# Altium project Highway_Final_Version.PrjPcb (part 1 of 2)
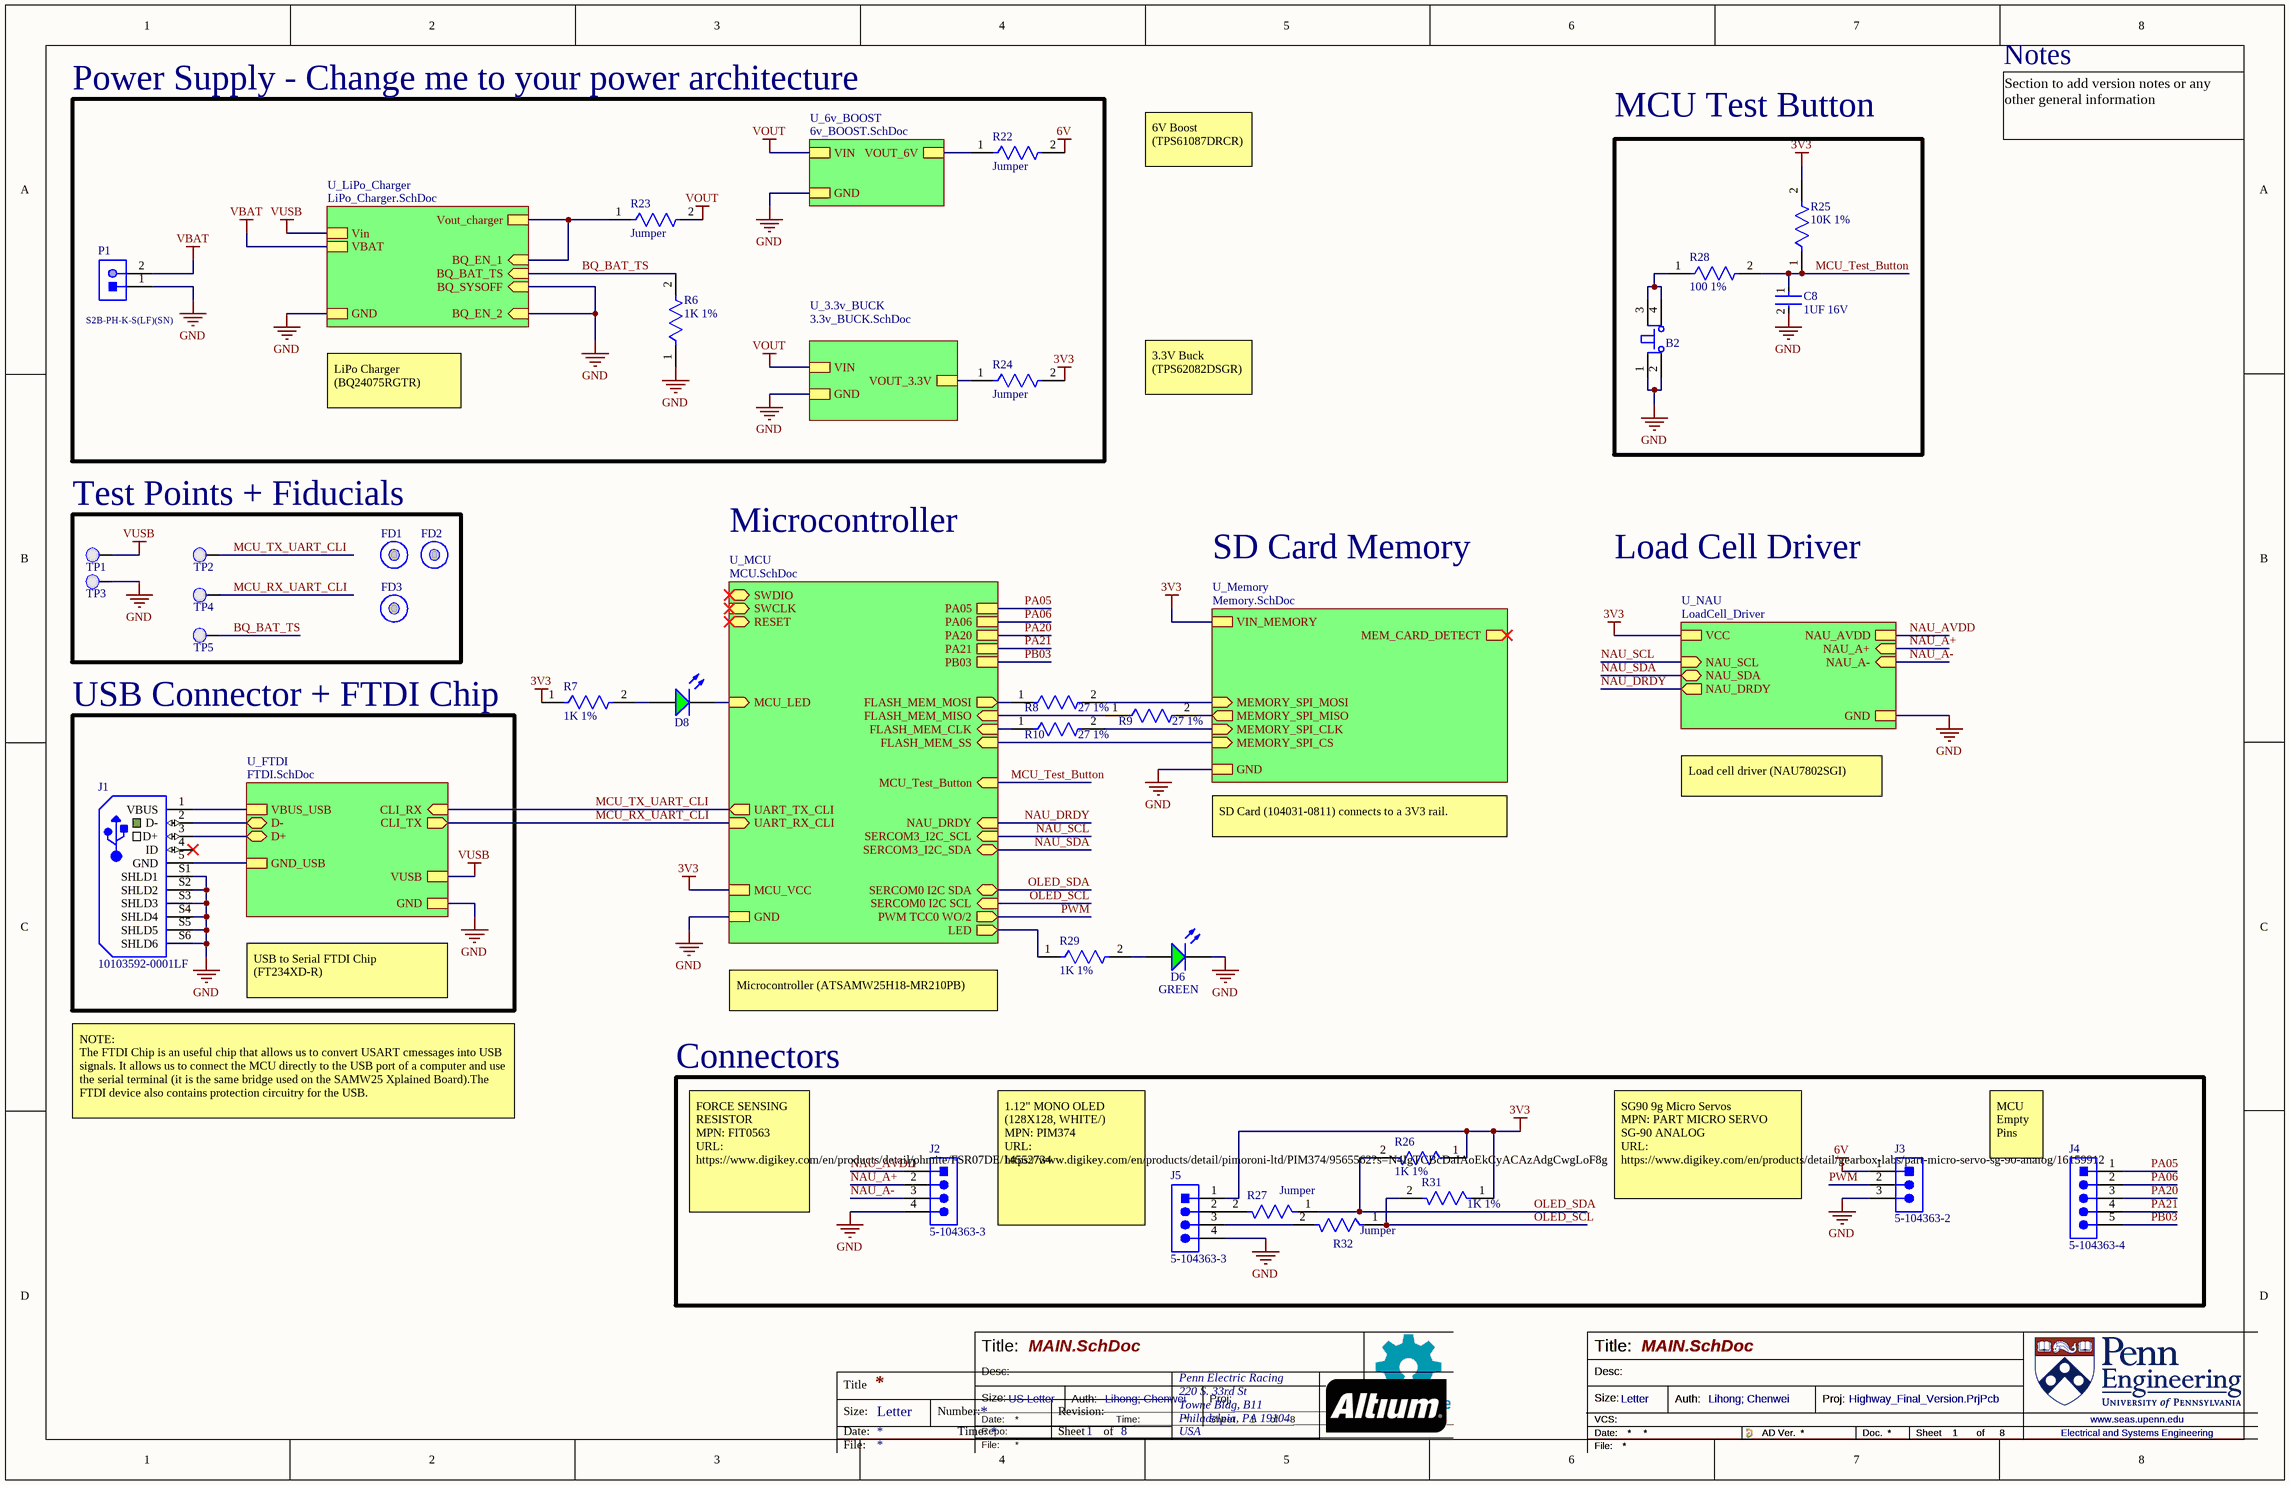
[diagram p0: MAIN.SchDoc]
8 sheets, 127 parts. Net scope: strictly hierarchical (ports join the sheet entries above them; power ports are local).
Board file: ESE516_PCB.PcbDoc
Sheets:
  MAIN.SchDoc
    U_FTDI = FTDI.SchDoc
    U_MCU = MCU.SchDoc
    U_Memory = Memory.SchDoc
    U_LiPo_Charger = LiPo_Charger.SchDoc
    U_6v_BOOST = 6v_BOOST.SchDoc
    U_3.3v_BUCK = 3.3v_BUCK.SchDoc
    U_NAU = LoadCell_Driver.SchDoc

## Sheet MAIN.SchDoc
size Tabloid; Author: Lihong; Chenwei; CompanyName: Penn Electric Racing; DrawnBy: Lihong; Chenwei; Engineer: Lihong; Chenwei; Organization: Penn Electric Racing; Address1: 220 S. 33rd St; Address2: Towne Bldg, B11; Address3: Philadelpia, PA 19104; Address4: USA; SheetNumber: 1; SheetTotal: 8

### Parts
B2  PTS810SJK250SMTRLFS  [PTS810SJK250SMTRLFS-Footprint-1]  (value not drawn)
C8  1UF 16V  [FP-CC0603-DA-MFG]
D6  GREEN  [LED_0805]
D8  LSM0805452V  [LED_0805]  (value not drawn)
FD1  Fiducial 40x100mm  [Fiducial 40x100mm-Footprint-1]  (value not drawn)
FD2  Fiducial 40x100mm  [Fiducial 40x100mm-Footprint-1]  (value not drawn)
FD3  Fiducial 40x100mm  [Fiducial 40x100mm-Footprint-1]  (value not drawn)
J1  10103592-0001LF  [10103592-0001LF-Footprint-1]
J2  5-104363-3  [5-104363-3-Footprint-1]
J3  5-104363-2  [5-104363-2-Footprint-1]
J4  5-104363-4  [5-104363-4-Footprint-1]
J5  5-104363-3  [5-104363-3-Footprint-1]
P1  S2B-PH-K-S(LF)(SN)  [JST-S2B-PH-K-S_V]
R6  1K 1%  [FP-RNCP0603-IPC_C]
R7  1K 1%  [FP-RNCP0603-IPC_C]
R8  27 1%  [FP-RMCF0603-IPC_B]
R9  27 1%  [FP-RMCF0603-IPC_B]
R10  27 1%  [FP-RMCF0603-IPC_B]
R22  Jumper  [FP-RMCF0603-MFG]
R23  Jumper  [FP-RMCF0603-MFG]
R24  Jumper  [FP-RMCF0603-MFG]
R25  10K 1%  [FP-RNCP0603-IPC_A]
R26  1K 1%  [FP-RNCP0603-IPC_C]
R27  Jumper  [FP-RMCF0603-MFG]
R28  100 1%  [FP-RMCF0603-IPC_C]
R29  1K 1%  [FP-RNCP0603-IPC_C]
R31  1K 1%  [FP-RNCP0603-IPC_C]
R32  Jumper  [FP-RMCF0603-MFG]
TP1  Test Point 0.1"  [Test Point 0.1"-Footprint-1]  (value not drawn)  (no BOM)
TP2  Test Point 0.1"  [Test Point 0.1"-Footprint-1]  (value not drawn)
TP3  Test Point 0.1"  [Test Point 0.1"-Footprint-1]  (value not drawn)
TP4  Test Point 0.1"  [Test Point 0.1"-Footprint-1]  (value not drawn)
TP5  Test Point 0.1"  [Test Point 0.1"-Footprint-1]  (value not drawn)

### Blocks framed on the sheet
Power Supply - Change me to your power architecture: P1 R6 R22-R24
MCU Test Button: B2 C8 R25 R28
Test Points + Fiducials: FD1-FD3 TP1-TP5
USB Connector + FTDI Chip: J1
Connectors: J2-J5 R26 R27 R31 R32

### Sub-sheets
U_3.3v_BUCK = 3.3v_BUCK.SchDoc: VIN, GND, VOUT_3.3V
U_6v_BOOST = 6v_BOOST.SchDoc: VIN, VOUT_6V, GND
U_FTDI = FTDI.SchDoc: CLI_RX (in), CLI_TX (out), VUSB, GND, VBUS_USB, D- (bidir), D+ (bidir), GND_USB
U_LiPo_Charger = LiPo_Charger.SchDoc: BQ_EN_2 (in), BQ_SYSOFF (in), BQ_EN_1 (in), BQ_BAT_TS (in), Vin, GND, VBAT, Vout_charger
U_MCU = MCU.SchDoc: SWDIO (bidir), SWCLK (in), UART_TX_CLI (out), UART_RX_CLI (in), FLASH_MEM_SS (in), FLASH_MEM_CLK (in), FLASH_MEM_MISO (in), FLASH_MEM_MOSI (out), RESET (bidir), MCU_LED (in), MCU_VCC, GND, SERCOM0 I2C SDA (bidir), SERCOM0 I2C SCL (in), PWM TCC0 WO/2 (out), LED (out), PA05, PA06, PA20, PA21, PB03, MCU_Test_Button (in), NAU_DRDY (in), SERCOM3_I2C_SCL (in), SERCOM3_I2C_SDA (bidir)
U_Memory = Memory.SchDoc: MEMORY_SPI_MOSI (in), MEMORY_SPI_MISO (out), MEMORY_SPI_CLK (in), MEMORY_SPI_CS (in), MEM_CARD_DETECT (out), VIN_MEMORY, GND
U_NAU = LoadCell_Driver: VCC, GND, NAU_AVDD, NAU_SCL (in), NAU_SDA (bidir), NAU_DRDY (out), NAU_A- (in), NAU_A+ (in)

### Nets
3V3: J5.1 R7.1 R24.2 R25.2 R26.1 R31.1 ; sheet U_MCU/MCU_VCC, sheet U_Memory/VIN_MEMORY, sheet U_NAU/VCC
6V: J3.1 R22.2
6V_out: R22.1 ; sheet U_6v_BOOST/VOUT_6V
GND: B2.1 B2.2 C8.2 D6.K J1.5(GND) J1.S1(SHLD1) J1.S2(SHLD2) J1.S3(SHLD3) J1.S4(SHLD4) J1.S5(SHLD5) J1.S6(SHLD6) J2.4 J3.3 J5.4 P1.1 R6.1 TP3.1(PAD) ; sheet U_FTDI/GND, sheet U_FTDI/GND_USB, sheet U_MCU/GND, sheet U_Memory/GND, sheet U_LiPo_Charger/BQ_EN_2, sheet U_LiPo_Charger/BQ_SYSOFF, sheet U_LiPo_Charger/GND, sheet U_6v_BOOST/GND, sheet U_3.3v_BUCK/GND, sheet U_NAU/GND
NAU_AVDD: J2.1 ; sheet U_NAU/NAU_AVDD  [project net AVDD]
VBAT: P1.2 ; sheet U_LiPo_Charger/VBAT
VBUS: J1.1(VBUS) ; sheet U_FTDI/VBUS_USB
VOUT: R23.2 ; sheet U_6v_BOOST/VIN, sheet U_3.3v_BUCK/VIN
Vout_BQ: R23.1 ; sheet U_LiPo_Charger/BQ_EN_1, sheet U_LiPo_Charger/Vout_charger
VUSB: TP1.1(PAD) ; sheet U_FTDI/VUSB, sheet U_LiPo_Charger/Vin
BQ_BAT_TS: R6.2 TP5.1(PAD) ; sheet U_LiPo_Charger/BQ_BAT_TS
FLASH_MEM_SPI_SS: sheet U_MCU/FLASH_MEM_SS, sheet U_Memory/MEMORY_SPI_CS
MCU_LED: D8.K ; sheet U_MCU/MCU_LED
MCU_RX_UART_CLI: TP4.1(PAD) ; sheet U_FTDI/CLI_TX, sheet U_MCU/UART_RX_CLI
MCU_Test_Button: C8.1 R25.1 R28.2 ; sheet U_MCU/MCU_Test_Button
MCU_TX_UART_CLI: TP2.1(PAD) ; sheet U_FTDI/CLI_RX, sheet U_MCU/UART_TX_CLI
MEM_SPI_CLK: R10.2 ; sheet U_Memory/MEMORY_SPI_CLK
MEM_SPI_MISO: R9.2 ; sheet U_Memory/MEMORY_SPI_MISO
MEM_SPI_MOSI: R8.2 ; sheet U_Memory/MEMORY_SPI_MOSI
NAU_A+: J2.2 ; sheet U_NAU/NAU_A+
NAU_A-: J2.3 ; sheet U_NAU/NAU_A-
NAU_DRDY: sheet U_MCU/NAU_DRDY, sheet U_NAU/NAU_DRDY
NAU_SCL: sheet U_MCU/SERCOM3_I2C_SCL, sheet U_NAU/NAU_SCL
NAU_SDA: sheet U_MCU/SERCOM3_I2C_SDA, sheet U_NAU/NAU_SDA
OLED_SCL: R31.2 R32.1 ; sheet U_MCU/SERCOM0 I2C SCL
OLED_SDA: R26.2 R27.1 ; sheet U_MCU/SERCOM0 I2C SDA
PA03: R29.1 ; sheet U_MCU/LED
PA05: J4.1 ; sheet U_MCU/PA05
PA06: J4.2 ; sheet U_MCU/PA06
PA20: J4.3 ; sheet U_MCU/PA20
PA21: J4.4 ; sheet U_MCU/PA21
PB03: J4.5 ; sheet U_MCU/PB03
PWM: J3.2 ; sheet U_MCU/PWM TCC0 WO/2
SERCOM1_PAD2_SPI_MISO: R9.1 ; sheet U_MCU/FLASH_MEM_MISO
SERCOM1_PAD2_SPI_MOSI: R8.1 ; sheet U_MCU/FLASH_MEM_MOSI
SERCOM1_PAD3_SPI_SCK: R10.1 ; sheet U_MCU/FLASH_MEM_CLK
USB_DATA_N: J1.2(D-) ; sheet U_FTDI/D-
USB_DATA_P: J1.3(D+) ; sheet U_FTDI/D+
VOS: R24.1 ; sheet U_3.3v_BUCK/VOUT_3.3V
NetB2_3: B2.3 B2.4 R28.1
NetD6_A: D6.A R29.2
NetD8_A: D8.A R7.2
NetJ5_2: J5.2 R27.2
NetJ5_3: J5.3 R32.2

Not connected (* = marked no-connect by the designer): J1 4(ID)*

### Notes on the sheet
- Notes
- 6V Boost (TPS61087DRCR)
- Section to add version notes or any other general information
- LiPo Charger (BQ24075RGTR)
- 3.3V Buck (TPS62082DSGR)
- Microcontroller
- SD Card Memory
- Load Cell Driver
- SD Card (104031-0811) connects to a 3V3 rail.
- Load cell driver (NAU7802SGI)
- USB to Serial FTDI Chip (FT234XD-R)
- Microcontroller (ATSAMW25H18-MR210PB)
- NOTE:
  The FTDI Chip is an useful chip that allows us to convert USART cmessages into USB signals. It allows us to connect the MCU directly to the USB port of a computer and use the serial terminal (it is the same bridge used on the SAMW25 Xplained Board).The FTDI device also contains protection circuitry for the USB.
- MCU Empty Pins
- FORCE SENSING RESISTOR
  MPN: FIT0563
  URL: https://www.digikey.com/en/products/detail/ohmite/FSR07DE/14552734
- 1.12" MONO OLED (128X128, WHITE/)
  MPN: PIM374
  URL: https://www.digikey.com/en/products/detail/pimoroni-ltd/PIM374/9565562?s=N4IgTCBcDaIAoEkCyACAzAdgCwgLoF8g
- SG90 9g Micro Servos
  MPN: PART MICRO SERVO SG-90 ANALOG
  URL: https://www.digikey.com/en/products/detail/gearbox-labs/part-micro-servo-sg-90-analog/16159912
- Title:
- Desc:
- Title
- Size:
- Date:
- Letter
- Number:
- Time:
- File:
- Repo:
- US Letter
- Revision:
- Sheet
- Auth:
- of
- Proj:
- www.seas.upenn.edu
- Electrical and Systems Engineering

### Library data of the parts
B2 = CMP-00084-2: Keypad Switch, 1 Switches, SPST, Momentary-tactile, 0.05A, 16VDC, 3.23N, Solder Terminal, Surface Mount-straight; Manufacturer Series: PTS810; Actuator Length: 0.028inch; Electrical Life: 50000Cycles; Contact Resistance: 0.5mR; Solderability: REFLOW; Actuator Travel: 0.1524mm; Actuator Color: White; Actuator Type: Pushbutton; Insulation Resistance: 100MR; Dielectric Withstand Volts: 250VACV; Switch Function: OFF-MOM; Reach SVHC Compliant: Yes; Terminal Finish: Silver; Switch Type: Keypad; Switch Action: MOMENTARY; RoHS Compliant: Yes; JESD-609 Code: e4; Max Operating Temperature: 85°C; Termination: Solder; Min Operating Temperature: -40°C; Mounting Technology: Surface Mount; Circuit: SPST; Type: Tactile
C8 = CMP-03422-001047-1: CC0603 1 uF X7R 10.00% 16 V; Manufacturer: YAGEO; Manufacturer Part Number: CC0603KPX7R7BB105; Temperature Coefficient: 15%; Tolerance: 0.1; Material: Ceramic; Device Class L3: Ceramic Capacitors; Temperature Characteristic: X7R; Device Class L2: Capacitors; Temperature Range Low: -55°C; Footprint Url: http://www.yageo.com/exep/pages/download/literatures/UPY-C_GEN_24.pdf; Device Class L1: Passive Components; Temperature: -55°C to +125°C; Voltage Rating: 16 V; RoHS: TRUE; ComponentLink2URL: http://www.yageo.com/documents/recent/UPY-GPHC_X7R_6.3V-to-50V_18.pdf; Mouser Description: Cap Ceramic 1uF 16V X7R 10% SMD 0603 125°C Paper T/R; Octopart: https://octopart.com/cc0603kpx7r7bb105-yageo-25629533; Automotive: No; Capacitance: 1 uF; Height: 0.9mm; Voltage: 16 V; Lead Free: Yes; Category: Cap; Package: CC0603-DA; Temperature Range High: +125°C; Value: 1 uF; ComponentLink2Description: Datasheet
D6 D8 = CMP-00038-3: Single Color LED, Green, 0805; Test Current: 20mA; Forward Voltage: 2V; RoHS Compliant: Yes
FD1-FD3 = CMP-00085-1
J1 = CMP-00092-5: Conn Micro USB 2.0 Type B RCP 5 POS 0.65mm Solder RA SMD 5 Terminal 1 Port T/R
J2 J5 = CMP-00105-2: Board Connector, 4 Contact(s), 1 Row(s), Male, Straight, 0.1 inch Pitch, Solder Terminal, Locking, Black Insulator, Plug
J3 = CMP-00106-1: Board Connector, 3 Contact(s), 1 Row(s), Male, Straight, 0.1 inch Pitch, Solder Terminal, Latch, Black Insulator, Plug
J4 = CMP-00107-1: Board Connector, 5 Contact(s), 1 Row(s), Male, Straight, 0.1 inch Pitch, Solder Terminal, Locking, Black Insulator, Plug
P1 = CMP-1755-00004-1: Male Header, Pitch 2 mm, 1 x 2 Position, Height 4.8 mm, Tail Length 3.4 mm, -25 to 85 degC, RoHS, Bulk; Case\Package: Radial; Tolerance: 20%; Capacitance: 10 uF; Voltage Rating (DC): 50 V; Packaging: Bulk; ComponentLink1URL: http://www.jst-mfg.com/product/pdf/eng/ePH.pdf; Radiation Hardening: No; Height: 11 mm; Package Quantity: 200; PackageDescription: Male Header, Pitch 2 mm, 1 x 2 Position, Height 4.8 mm, Tail Length 3.4 mm; PackageReference: S2B-PH-K-S; Diameter: 5 mm; Pins: 2; Mount: Through Hole; Max Operating Temperature: 85 degC; Min Operating Temperature: -40 degC; ComponentLink1Description: Datasheet; DatasheetVersion: Dec-12; Length: 11 mm; Lead Pitch: 2 mm; REACH SVHC: No SVHC; Voltage Rating: 50 V; RoHSCompliant: true
R6 R7 R26 R29 R31 = CMP-26527-006179-1: 1kΩ ±1% 0.125W 0603 High Power Anti-Sulfur Thin Film Chip Resistor; Temperature Coefficient: 100ppm/°C; Max Power Dissipation: 125mW; Resistance: 1kR; Case/Package: 0603; Width: 0.031inch; Tolerance: 1%; Case Code (Imperial): 0603; RoHS Compliant: Yes; Min Operating Temperature: -55°C; Resistor Type: Thin Film; Features: Moisture Resistant; Length: 0.059inch; Mount: Surface Mount; Case Code (Metric): 1608; Height: 0.02inch; Max Operating Temperature: 155°C; Packaging: Tape and Reel; Series: RNCP; Number of Terminations: 2
R8-R10 = CMP-26527-005743-1: 27Ω ±1% 0.1W 0603 Thick Film Chip Resistor AEC-Q200 compliant; Max Power Dissipation: 100mW; Resistance: 27R; Temperature Coefficient: 100ppm/°C; Case/Package: 0603; Contact Plating: Tin; Packaging: Tape and Reel; Length: 0.061inch; Radiation Hardening: No; Mount: Surface Mount; Series: RMCF; Min Operating Temperature: -55°C; Lead Free: Lead Free; Width: 0.031inch; Resistor Type: Thick Film; Max Operating Temperature: 155°C; RoHS Compliant: Yes; Case Code (Imperial): 0603; Height: 0.022inch; Number of Terminations: 2; Case Code (Metric): 1608; Tolerance: 1%; Features: Automotive AEC-Q200
R22-R24 R27 R32 = CMP-26527-000011-1: RES 0 OHM JUMPER 1/10W 0603; Manufacturer Part Number: RMCF0603ZT0R00; Manufacturer: Stackpole; Power Rating: 0.1W; Voltage Rating: 75V; Resistance: 0mΩ; Automotive Grade: Grade 0; Value: 0mΩ; Series: RMCF; Device Class L1: Passive Components; Device Class L3: Chip SMD Resistors; Octopart: https://octopart.com/rmcf0603zt0r00-stackpole+electronics-19213618; Temperature: -55°C to +155°C; Lead Free: Yes; ComponentLink2URL: https://www.seielect.com/catalog/sei-rmcf_rmcp.pdf; Height: 0.55mm; Composition: Thick Film; Package: RMCF0603; Automotive: Yes; Temperature Range High: +155°C; Ipc Land Pattern Name: RESC15580X45; Digikey Description: RES 0 OHM JUMPER 1/10W 0603; RoHS: TRUE; ComponentLink2Description: Datasheet; Temperature Range Low: -55°C; Category: Res; Device Class L2: Resistors
R25 = CMP-26527-000099-1: 10kΩ ±1% 0.125W 0603 High Power Anti-Sulfur Thin Film Chip Resistor; Resistance: 10kR; Max Power Dissipation: 125mW; Temperature Coefficient: 100ppm/°C; Max Operating Temperature: 155°C; Width: 0.031inch; Height: 0.02inch; Lead Free: Lead Free; Contact Plating: Tin; Tolerance: 1%; Resistor Type: Thin Film; Series: RNCP; RoHS Compliant: Yes; Features: Moisture Resistant; Min Operating Temperature: -55°C; Case Code (Metric): 1608; Case/Package: 0603; Mount: Surface Mount; Packaging: Tape and Reel; Radiation Hardening: No; Length: 0.059inch; Number of Terminations: 2; Case Code (Imperial): 0603
R28 = CMP-26527-006079-1: 100Ω ±1% 0.1W 0603 Thick Film Chip Resistor AEC-Q200 compliant; Resistance: 100R; Power Rating: 100mW; Temperature Coefficient: 100ppm/°C; Radiation Hardening: No; Case Code (Metric): 1608; RoHS Compliant: Yes; Height: 0.022inch; Case/Package: 0603; Construction: Rectangular; Case Code (Imperial): 0603; Series: RMCF; Military Standard: Not; Max Operating Temperature: 155°C; Resistor Type: Thick Film; Depth: 0.8mm; Features: Automotive AEC-Q200; Width: 0.031inch; Length: 1.55mm; Size Code: 0603; Mount: Surface Mount; Contact Plating: Tin; Max Power Dissipation: 100mW; Number of Terminations: 2; Min Operating Temperature: -55°C; Packaging: Tape and Reel; Lead Free: Lead Free; Tolerance: 1%
TP1-TP5 = CMP-00086-1

## Sheet FTDI.SchDoc
size Letter; Author: Lihong; Chenwei; SheetNumber: 5; SheetTotal: 8
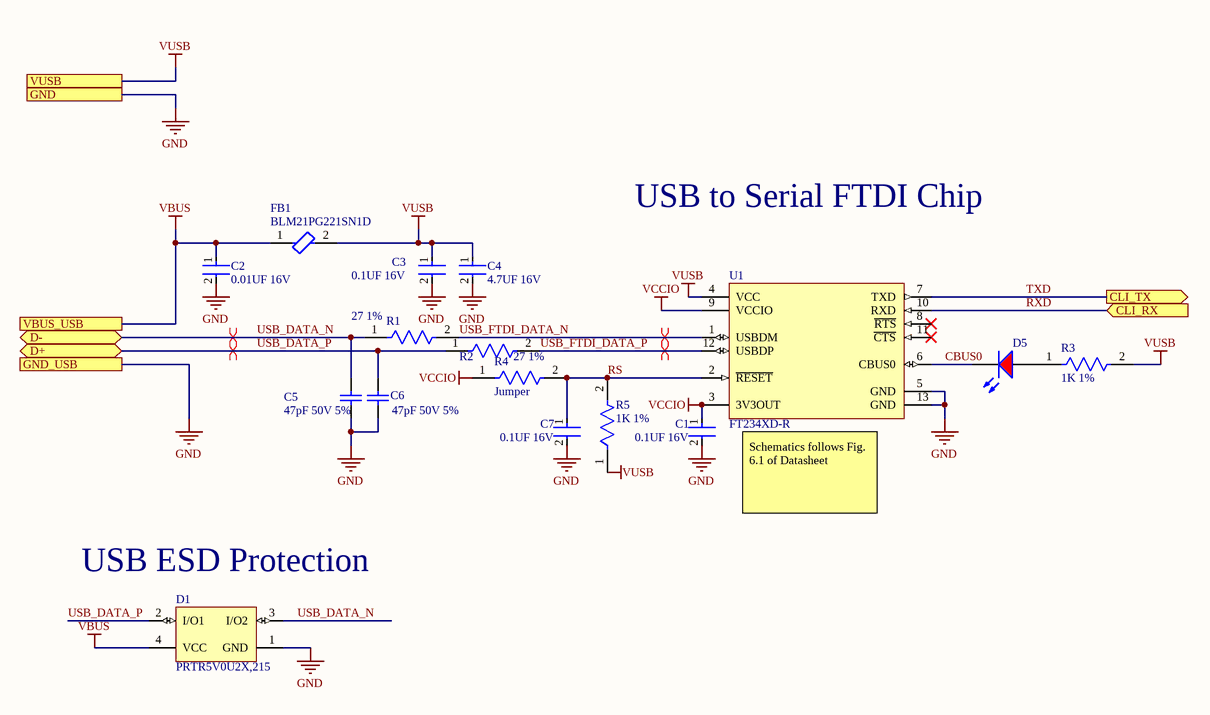
[diagram p1: FTDI.SchDoc]

### Parts
C1  0.1UF 16V  [FP-CC0402-MFG]
C2  0.01UF 16V  [FP-CC0402-MFG]
C3  0.1UF 16V  [FP-CC0402-MFG]
C4  4.7UF 16V  [FP-CC0402-MFG]
C5  47pF 50V 5%  [0603_CAP]
C6  47pF 50V 5%  [0603_CAP]
C7  0.1UF 16V  [FP-CC0402-MFG]
D1  PRTR5V0U2X,215  [NXP-SOT143B-4_V]
D5  LSM0805412V  [LED_0805_RED]  (value not drawn)
FB1  BLM21PG221SN1D  [FP-BLM21-0_2-t0_85-e0_5-IPC_B]
R1  27 1%  [FP-RMCF0603-IPC_B]
R2  27 1%  [FP-RMCF0603-IPC_B]
R3  1K 1%  [FP-RNCP0603-IPC_C]
R4  Jumper  [FP-RMCF0603-MFG]
R5  1K 1%  [FP-RNCP0603-IPC_C]
U1  FT234XD-R  [FP-DFN-12-MFG]

### Ports
CLI_RX (in), CLI_TX (out), D+ (bidir), D- (bidir), GND, GND_USB, VBUS_USB, VUSB

### Nets
GND: C1.2 C2.2 C3.2 C4.2 C5.1 C6.1 C7.2 D1.1(GND) U1.5(GND) U1.13(GND) ; port GND, port GND_USB
VBUS: C2.1 D1.4(VCC) FB1.1 ; port VBUS_USB
VCCIO: C1.1 R4.1 U1.3(3V3OUT) U1.9(VCCIO)
VUSB: C3.1 C4.1 FB1.2 R3.2 R5.1 U1.4(VCC) ; port VUSB
CBUS0: D5.K U1.6(CBUS0)
RS: C7.1 R4.2 R5.2 U1.2(~{RESET})
RXD: U1.10(RXD) ; port CLI_RX  [project net MCU_TX_UART_CLI]
TXD: U1.7(TXD) ; port CLI_TX  [project net MCU_RX_UART_CLI]
USB_DATA_N: C5.2 D1.3(I/O2) R1.1 ; port D-
USB_DATA_P: C6.2 D1.2(I/O1) R2.1 ; port D+
USB_FTDI_DATA_N: R1.2 U1.1(USBDM)
USB_FTDI_DATA_P: R2.2 U1.12(USBDP)
NetD5_A: D5.A R3.1

Not connected (* = marked no-connect by the designer): U1 8(~{RTS})* 11(~{CTS})*

### Layout directives
differential pair: USB_DATA_N, USB_DATA_P, USB_FTDI_DATA_N, USB_FTDI_DATA_P

### Notes on the sheet
- USB to Serial FTDI Chip
- Schematics follows Fig. 6.1 of Datasheet
- (near D1) USB ESD Protection
- Title:
- Desc:
- Size:
- Letter
- Auth:
- Proj:
- Sheet
- of
- www.seas.upenn.edu
- Electrical and Systems Engineering

### Library data of the parts
C1 C3 C7 = CMP-03422-000946-1: CC0402 100 nF X7R 10.00% 25 V; Manufacturer Part Number: CC0402KPX7R8BB104; Manufacturer: YAGEO; Capacitance: 100 nF; Material: Ceramic; Tolerance: 0.1; Value: 100 nF; Temperature Coefficient: 30ppm/°C; Automotive Grade: NA; Voltage Rating: 25 V; Footprint Url: http://www.yageo.com/exep/pages/download/literatures/UPY-C_GEN_24.pdf; ComponentLink2Description: Datasheet; Device Class L2: Capacitors; Device Class L3: Ceramic Capacitors; Height: 0.55mm; Ipc Land Pattern Name: CAPC10050X50; Category: Cap; ComponentLink2URL: http://www.yageo.com/documents/recent/UPY-GP_NP0_16V-to-50V_16.pdf; Automotive: No; Temperature: -55°C to +125°C; Lead Free: Yes; Temperature Range High: +125°C; Temperature Range Low: -55°C; Temperature Characteristic: X7R; Package: CC0402; RoHS: TRUE; Octopart: https://octopart.com/cc0402kpx7r8bb104-yageo-61757486; Device Class L1: Passive Components
C2 = CMP-03422-000420-1: CC0402 10 nF X7R 10.00% 16 V; Manufacturer: YAGEO; Manufacturer Part Number: CC0402KPX7R7BB103; Capacitance: 10 nF; Value: 10 nF; Tolerance: 0.1; Automotive Grade: NA; Temperature Coefficient: 30ppm/°C; Material: Ceramic; Automotive: No; Device Class L1: Passive Components; Temperature Range Low: -55°C; Ipc Land Pattern Name: CAPC10050X50; Temperature Characteristic: X7R; Voltage Rating: 16 V; Lead Free: Yes; Footprint Url: http://www.yageo.com/exep/pages/download/literatures/UPY-C_GEN_24.pdf; Octopart: https://octopart.com/cc0402kpx7r7bb103-yageo-12885102; RoHS: TRUE; Height: 0.55mm; Device Class L3: Ceramic Capacitors; Mouser Description: Multilayer Ceramic Capacitors MLCC - SMD/SMT 10nF 16V X7R 10%; Package: CC0402; ComponentLink2Description: Datasheet; Category: Cap; ComponentLink2URL: http://www.yageo.com/documents/recent/UPY-GP_NP0_16V-to-50V_16.pdf; Temperature: -55°C to +125°C; Temperature Range High: +125°C; Device Class L2: Capacitors
C4 = CMP-03422-000634-1: CAP CER 4700PF 25V X7R 0402; Manufacturer Part Number: CC0402KRX7R8BB472; Manufacturer: YAGEO; Material: Ceramic; Automotive Grade: NA; Value: 4.7 nF; Tolerance: 0.1; Temperature Coefficient: 30ppm/°C; ComponentLink2URL: http://www.yageo.com/documents/recent/UPY-GP_NP0_16V-to-50V_16.pdf; Digikey Description: CAP CER 4700PF 25V X7R 0402; RoHS: TRUE; Ipc Land Pattern Name: CAPC10050X50; Footprint Url: http://www.yageo.com/exep/pages/download/literatures/UPY-C_GEN_24.pdf; Voltage Rating: 25 V; Mouser Description: 0402 4.7 nF 25 V ±10 % Tolerance X7R SMT Multilayer Ceramic Capacitor; Device Class L3: Ceramic Capacitors; Device Class L1: Passive Components; ComponentLink2Description: Datasheet; Temperature Range Low: -55°C; Device Class L2: Capacitors; Category: Cap; Octopart: https://octopart.com/cc0402krx7r8bb472-yageo-40254851; Lead Free: Yes; Height: 0.55mm; Temperature: -55°C to +125°C; Automotive: No; Temperature Range High: +125°C; Capacitance: 4.7 nF; Package: CC0402; Temperature Characteristic: X7R
C5 C6 = CMP-011-000339-1: Capacitor Surface Mount 0603 Footprint 47PF 50V 5% Tolerance Ceramic C0G; Manufacturer P/N: CAP 0603 47PF 50V 5% C0G; Manufacturer: Various; Description in Visual: Cap SMT 0603 47PF 50V 5%  Cer C0G; PCB Package: 0603; Value: 47PF; Voltage: 50V; P/N: CAP 0603 47PF 50V 5% C0G; Mount: SMT; Tolerance: 5%; Type: Ceramic C0G
D1 = CMP-2000-05285-1: Ultra Low Capacitance Double Rail-to-Rail ESD Protection Diode, 5.5 V, 1 pF, -40 to 85 degC, 4-Pin SOT143B, RoHS, Tape and Reel; Manufacturer: NXP Semiconductors; Capacitance Value: 16pF; Number of Elements: 1; Rad Hardened: No; Reverse Breakdown Voltage: 6V; Working Voltage (Max): 5.5V; Polarity: Uni-Directional; Configuration: Quad; Leakage Current: 0.1uA; Product Height (mm): 1mm; Suppressor Type: DiodeArrays; Product Length (mm): 3mm; Product Depth (mm): 1.4mm; ESD Protection Voltage: 8KV@ContactDisc; Package Type: SOT; Mounting: SurfaceMount; Packaging: TapeandReel; Datasheet Version: Rev. 02, 01/2008; Reverse Stand-off Voltage: 5.5V; Manufacturer URL: http://www.nxp.com/; Operating Temp Range: -40Cto85C; Operating Temperature Classification: Industrial; Working Voltage: 5.5V; Operating Temperature Min Deg. C: -40C; Datasheet URL: https://datasheet.ciiva.com/4479/prtr5v0u2x-102853-4479461.pdf; Leakage Current (Max): 0.1uA; Direction Type: Uni-Directional; Pin Count: 3+Tab; Operating Temperature Max Deg. C: 85C; Mounting Style: SurfaceMount; Package / Case: SOT
D5 = CMP-00026-00001-1: Single Color LED, RED, 0805; Test Current: 20mA; Forward Voltage: 2V; RoHS Compliant: Yes
FB1 = CMP-0686-00610-3: Chip Ferrite Bead, 0805, 220Ω @ 100MHz, 0.045Ω, 25%, 2A; Number of Circuits: 1; Shielding: Unshielded; DC Resistance (DCR): 45mR; Impedance: 220R; Radiation Hardening: No; Material: Ferrite; Frequency: 100MHz; Width: 1.25mm; DC Current: 2A; Max DC Current: 2A; Number of Lines: 1; Package Quantity: 1; Case Code (Metric): 2012; Current Rating: 2A; Case/Package: 0805; Current: 2A; Military Standard: Not; Core Material: Ferrite; Depth: 1.25mm; Contact Plating: Tin; DC Resistance-Max: 45mR; Max Operating Temperature: 125°C; Length: 2mm; Max Current Rating: 2A; REACH SVHC: No SVHC; Termination: SMD/SMT; Min Operating Temperature: -55°C; Series: BLM21P; Test Frequency: 100MHz; Tolerance: 25%; Number of Pins: 2; RoHS Compliant: Yes; Height: 0.85mm; Packaging: Tape and Reel; Lead Free: Lead Free; Case Code (Imperial): 0805
R1 R2 = CMP-26527-005743-1: as R8 on sheet MAIN; Case/Package: 0603; Contact Plating: Tin; Packaging: Tape and Reel; Length: 0.061inch; Radiation Hardening: No; Mount: Surface Mount; Series: RMCF; Min Operating Temperature: -55°C; Lead Free: Lead Free; Width: 0.031inch; Resistor Type: Thick Film; Max Operating Temperature: 155°C; RoHS Compliant: Yes; Case Code (Imperial): 0603; Height: 0.022inch; Number of Terminations: 2; Case Code (Metric): 1608; Tolerance: 1%; Features: Automotive AEC-Q200
R3 R5 = CMP-26527-006179-1: as R6 on sheet MAIN; Case/Package: 0603; Width: 0.031inch; Tolerance: 1%; Case Code (Imperial): 0603; RoHS Compliant: Yes; Min Operating Temperature: -55°C; Resistor Type: Thin Film; Features: Moisture Resistant; Length: 0.059inch; Mount: Surface Mount; Case Code (Metric): 1608; Height: 0.02inch; Max Operating Temperature: 155°C; Packaging: Tape and Reel; Series: RNCP; Number of Terminations: 2
R4 = CMP-26527-000011-1: as R22 on sheet MAIN; Series: RMCF; Device Class L1: Passive Components; Device Class L3: Chip SMD Resistors; Octopart: https://octopart.com/rmcf0603zt0r00-stackpole+electronics-19213618; Temperature: -55°C to +155°C; Lead Free: Yes; ComponentLink2URL: https://www.seielect.com/catalog/sei-rmcf_rmcp.pdf; Height: 0.55mm; Composition: Thick Film; Package: RMCF0603; Automotive: Yes; Temperature Range High: +155°C; Ipc Land Pattern Name: RESC15580X45; Digikey Description: RES 0 OHM JUMPER 1/10W 0603; RoHS: TRUE; ComponentLink2Description: Datasheet; Temperature Range Low: -55°C; Category: Res; Device Class L2: Resistors
U1 = CMP-00104-3: USB Bridge, USB to UART USB 2.0 UART Interface 12-DFN (3x3); Power Supplies: 1.8/3.3,3.3/5V; Min Supply Voltage: 2.97V; Time @ Peak Reflow Temperature-Max (s): 40s; Package Body Material: Plastic; Nominal Supply Voltage: 5V; Max Supply Voltage: 5.5V; Qualification Status: Not Qualified; Length: 3mm; Surface Mount: Yes; Moisture Sensitivity Level: 3; Min Operating Temperature: -40°C; Width: 3mm; Terminal Pitch: 0.45mm; Terminal Position: DUAL; RoHS Compliant: Yes; Terminal Form: No Lead; Technology: CMOS; Reach SVHC Compliant: Yes; Case/Package: HTSON; Peak Reflow Temperature (Cel): 260°C; Package Shape: Square; Pins: 12; Temperature Grade: INDUSTRIAL; Package Style: SMALL OUTLINE, HEAT SINK/SLUG, THIN PROFILEMeter; Max Operating Temperature: 85°C

## Sheet MCU.SchDoc
size Legal; Author: Lihong; Chenwei; SheetNumber: 3; SheetTotal: 8
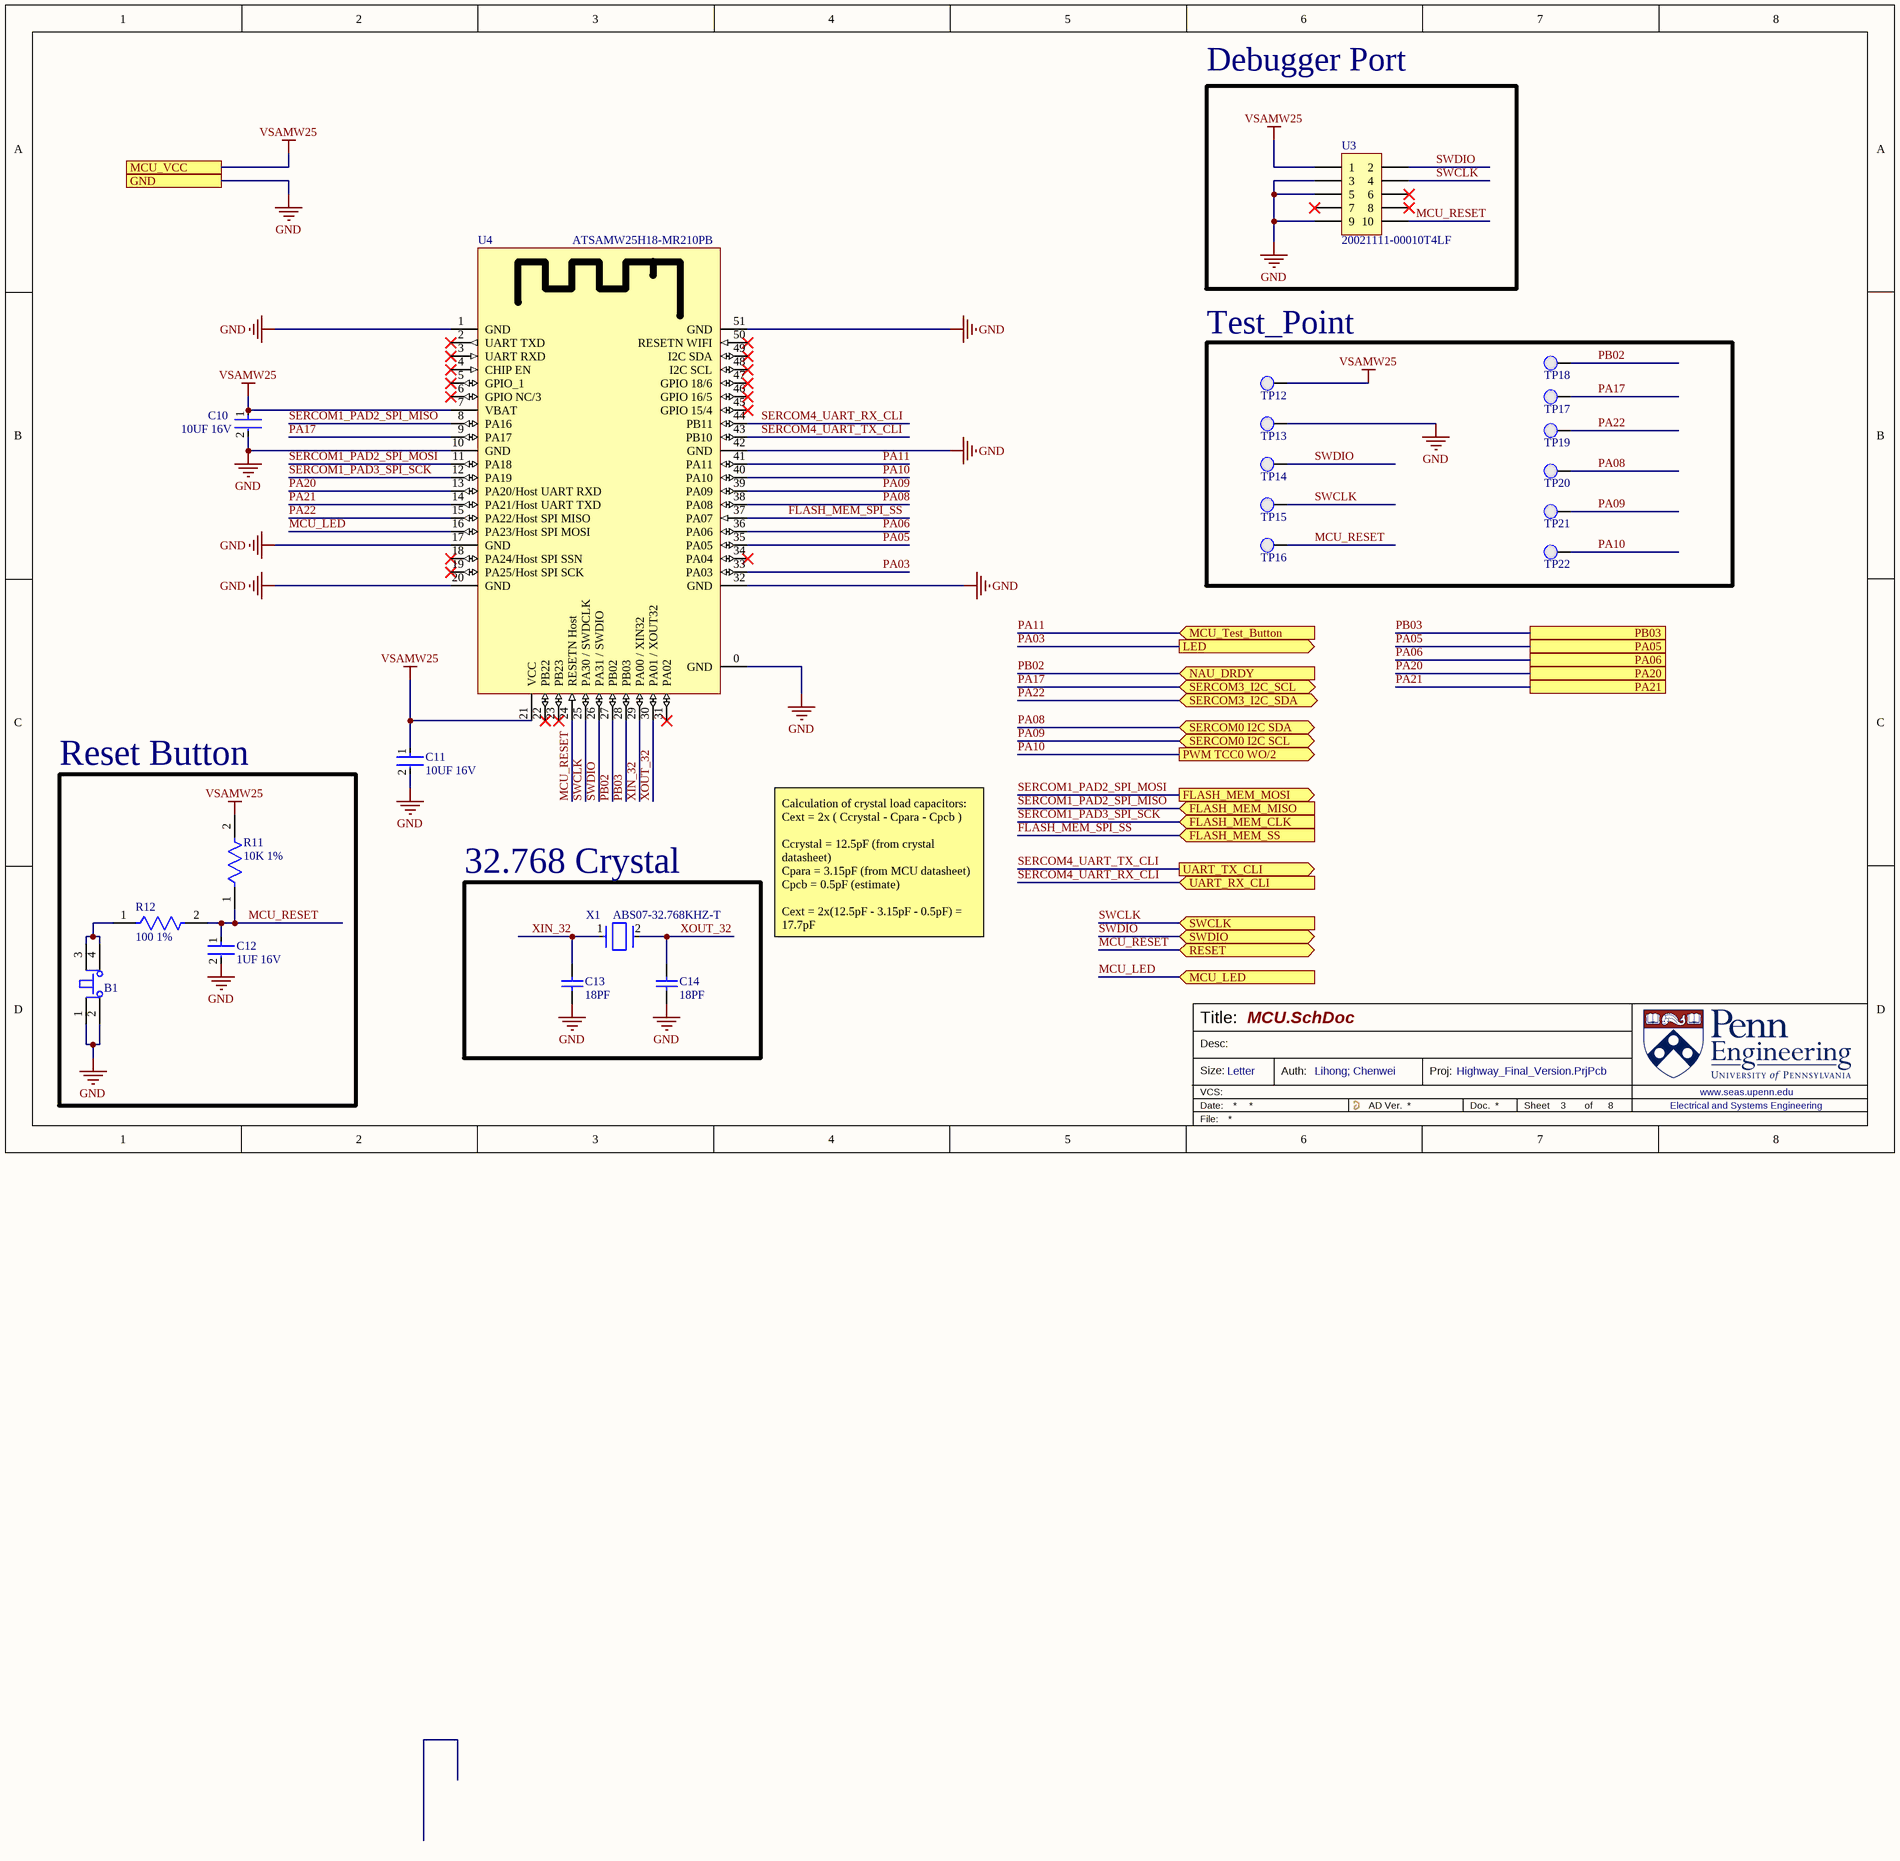
[diagram p2: MCU.SchDoc]

### Parts
B1  PTS810SJK250SMTRLFS  [PTS810SJK250SMTRLFS-Footprint-1]  (value not drawn)
C10  10UF 16V  [FP-CC0603-DB-MFG]
C11  10UF 16V  [FP-CC0603-DB-MFG]
C12  1UF 16V  [FP-CC0603-DA-MFG]
C13  18PF  [CAPC1608X90X40LL10T20]
C14  18PF  [CAPC1608X90X40LL10T20]
R11  10K 1%  [FP-RNCP0603-IPC_A]
R12  100 1%  [FP-RMCF0603-IPC_C]
TP12  Test Point 0.1"  [Test Point 0.1"-Footprint-1]  (value not drawn)
TP13  Test Point 0.1"  [Test Point 0.1"-Footprint-1]  (value not drawn)
TP14  Test Point 0.1"  [Test Point 0.1"-Footprint-1]  (value not drawn)
TP15  Test Point 0.1"  [Test Point 0.1"-Footprint-1]  (value not drawn)
TP16  Test Point 0.1"  [Test Point 0.1"-Footprint-1]  (value not drawn)
TP17  Test Point 0.1"  [Test Point 0.1"-Footprint-1]  (value not drawn)  (no BOM)
TP18  Test Point 0.1"  [Test Point 0.1"-Footprint-1]  (value not drawn)  (no BOM)
TP19  Test Point 0.1"  [Test Point 0.1"-Footprint-1]  (value not drawn)  (no BOM)
TP20  Test Point 0.1"  [Test Point 0.1"-Footprint-1]  (value not drawn)  (no BOM)
TP21  Test Point 0.1"  [Test Point 0.1"-Footprint-1]  (value not drawn)  (no BOM)
TP22  Test Point 0.1"  [Test Point 0.1"-Footprint-1]  (value not drawn)  (no BOM)
U3  20021111-00010T4LF  [20021111-00010T4LF-Footprint-1]
U4  ATSAMW25H18-MR210PB  [SAMW25H18-MR510PB-Footprint-1]
X1  ABS07-32.768KHZ-T  [FP-ABS07-MFG]

### Blocks framed on the sheet
Debugger Port: U3
Test_Point: TP12-TP22
Reset Button: B1 C12 R11 R12
32.768 Crystal: C13 C14 X1

### Ports
FLASH_MEM_CLK (in), FLASH_MEM_MISO (in), FLASH_MEM_MOSI (out), FLASH_MEM_SS (in), GND, LED (out), MCU_LED (in), MCU_Test_Button (in), MCU_VCC, NAU_DRDY (in), PA05, PA06, PA20, PA21, PB03, PWM TCC0 WO/2 (out), RESET (bidir), SERCOM0 I2C SCL (bidir), SERCOM0 I2C SDA (bidir), SERCOM3_I2C_SCL (bidir), SERCOM3_I2C_SDA (bidir), SWCLK (in), SWDIO (bidir), UART_RX_CLI (in), UART_TX_CLI (out)

### Nets
GND: B1.1 B1.2 C10.2 C11.2 C12.2 C13.1 C14.2 TP13.1(PAD) U3.3 U3.5 U3.9 U4.0(GND) U4.1(GND) U4.10(GND) U4.17(GND) U4.20(GND) U4.32(GND) U4.42(GND) U4.51(GND) ; port GND
VSAMW25: C10.1 C11.1 R11.2 TP12.1(PAD) U3.1 U4.7(VBAT) U4.21(VCC) ; port MCU_VCC  [project net 3V3]
FLASH_MEM_SPI_SS: U4.37(PA07) ; port FLASH_MEM_SS
MCU_LED: U4.16(PA23/Host_SPI_MOSI) ; port MCU_LED
MCU_RESET: C12.1 R11.1 R12.2 TP16.1(PAD) U3.10 U4.24(RESETN_Host) ; port RESET
PA03: U4.33(PA03) ; port LED
PA05: U4.35(PA05) ; port PA05
PA06: U4.36(PA06) ; port PA06
PA08: TP20.1(PAD) U4.38(PA08) ; port SERCOM0 I2C SDA  [project net OLED_SDA]
PA09: TP21.1(PAD) U4.39(PA09) ; port SERCOM0 I2C SCL  [project net OLED_SCL]
PA10: TP22.1(PAD) U4.40(PA10) ; port PWM TCC0 WO/2  [project net PWM]
PA11: U4.41(PA11) ; port MCU_Test_Button  [project net MCU_Test_Button]
PA17: TP17.1(PAD) U4.9(PA17) ; port SERCOM3_I2C_SCL  [project net NAU_SCL]
PA20: U4.13(PA20/Host_UART_RXD) ; port PA20
PA21: U4.14(PA21/Host_UART_TXD) ; port PA21
PA22: TP19.1(PAD) U4.15(PA22/Host_SPI_MISO) ; port SERCOM3_I2C_SDA  [project net NAU_SDA]
PB02: TP18.1(PAD) U4.27(PB02) ; port NAU_DRDY  [project net NAU_DRDY]
PB03: U4.28(PB03) ; port PB03
SERCOM1_PAD2_SPI_MISO: U4.8(PA16) ; port FLASH_MEM_MISO
SERCOM1_PAD2_SPI_MOSI: U4.11(PA18) ; port FLASH_MEM_MOSI
SERCOM1_PAD3_SPI_SCK: U4.12(PA19) ; port FLASH_MEM_CLK
SERCOM4_UART_RX_CLI: U4.44(PB11) ; port UART_RX_CLI  [project net MCU_RX_UART_CLI]
SERCOM4_UART_TX_CLI: U4.43(PB10) ; port UART_TX_CLI  [project net MCU_TX_UART_CLI]
SWCLK: TP15.1(PAD) U3.4 U4.25(PA30_/_SWDCLK) ; port SWCLK
SWDIO: TP14.1(PAD) U3.2 U4.26(PA31_/_SWDIO) ; port SWDIO
XIN_32: C13.2 U4.29(PA00_/_XIN32) X1.1
XOUT_32: C14.1 U4.30(PA01_/_XOUT32) X1.2
NetB1_3: B1.3 B1.4 R12.1

Not connected (* = marked no-connect by the designer): U3 6* 7* 8*; U4 2(UART_TXD)* 3(UART_RXD)* 4(CHIP_EN)* 5(GPIO_1)* 6(GPIO_NC/3)* 18(PA24/Host_SPI_SSN)* 19(PA25/Host_SPI_SCK)* 22(PB22)* 23(PB23)* 31(PA02)* 34(PA04)* 45(GPIO_15/4)* 46(GPIO_16/5)* 47(GPIO_18/6)* 48(I2C_SCL)* 49(I2C_SDA)* 50(RESETN_WIFI)*

### Notes on the sheet
- Calculation of crystal load capacitors:
  Cext = 2x ( Ccrystal - Cpara - Cpcb )
  Ccrystal = 12.5pF (from crystal datasheet)
  Cpara = 3.15pF (from MCU datasheet)
  Cpcb = 0.5pF (estimate)
  Cext = 2x(12.5pF - 3.15pF - 0.5pF) = 17.7pF
- Title:
- Desc:
- Size:
- Letter
- Auth:
- Proj:
- Sheet
- of
- www.seas.upenn.edu
- Electrical and Systems Engineering

### Library data of the parts
B1 = CMP-00084-2: as B2 on sheet MAIN; Reach SVHC Compliant: Yes; Terminal Finish: Silver; Switch Type: Keypad; Switch Action: MOMENTARY; RoHS Compliant: Yes; JESD-609 Code: e4; Max Operating Temperature: 85°C; Termination: Solder; Min Operating Temperature: -40°C; Mounting Technology: Surface Mount; Circuit: SPST; Type: Tactile
C10 C11 = CMP-1035-02797-2: CAP CER 10UF 6.3V X5R 0603; Dissipation Factor: 10%; Tolerance: 20%; Depth: 0.8mm; Dielectric: X5R; Height: 0.8mm; Min Operating Temperature: -55°C; Package Quantity: 4000; Radiation Hardening: No; Mount: Surface Mount; Termination: SMD/SMT; Case/Package: 0603; Max Operating Temperature: 85°C; Case Code (Imperial): 0603; RoHS Compliant: Yes; Number of Pins: 2; Lead Free: Lead Free; Resistor Type: Ceramic; Thickness: 0.039inch; Construction: Flat; Width: 0.031inch; Length: 1.6mm; Capacitance: 10uF; Voltage Rating: 6.3V; Series: CC; REACH SVHC: No SVHC; Packaging: Tape and Reel; Case Code (Metric): 1608; Voltage Rating (DC): 6.3V; Halogen Free: Halogen Free
C12 = CMP-03422-001047-1: as C8 on sheet MAIN; Device Class L3: Ceramic Capacitors; Temperature Characteristic: X7R; Device Class L2: Capacitors; Temperature Range Low: -55°C; Footprint Url: http://www.yageo.com/exep/pages/download/literatures/UPY-C_GEN_24.pdf; Device Class L1: Passive Components; Temperature: -55°C to +125°C; Voltage Rating: 16 V; RoHS: TRUE; ComponentLink2URL: http://www.yageo.com/documents/recent/UPY-GPHC_X7R_6.3V-to-50V_18.pdf; Mouser Description: Cap Ceramic 1uF 16V X7R 10% SMD 0603 125°C Paper T/R; Octopart: https://octopart.com/cc0603kpx7r7bb105-yageo-25629533; Automotive: No; Capacitance: 1 uF; Height: 0.9mm; Voltage: 16 V; Lead Free: Yes; Category: Cap; Package: CC0603-DA; Temperature Range High: +125°C; Value: 1 uF; ComponentLink2Description: Datasheet
C13 C14 = CMP-1659-00030-1: Chip Capacitor, 18 pF, +/- 5%, 50 V, -55 to 125 degC, 0603 (1608 Metric), RoHS, Tape and Reel; Voltage Rating: 50 V; Case\Package: 0603; Power Rating: 100 mW; Resistance: 68.1 Ohm; Tolerance: 1%; Case Code (Metric): 1608; Max Operating Temperature: 155 degC; RoHSCompliant: true; Case Code (Imperial): 0603; ComponentLink2Description: Datasheet; Package Quantity: 200; PackageReference: 0603; ComponentLink2URL: http://www.yageo.com/NewPortal/yageodocoutput?fileName=/pdf/MLCC/UPY-GP_NP0_16V-to-50V_14.pdf; Length: 1.6 mm; DatasheetVersion: Rev. 14, 07/2016; Min Operating Temperature: -55 degC; ComponentLink1URL: http://www.yageo.com/; Width: 0.8 mm; ComponentLink1Description: Manufacturer URL; Height: 0.45 mm; Radiation Hardening: No; PackageDescription: 2-Pin Surface Mount Device, Body 1.6 x 0.8 mm; Packaging: Tape and Reel
R11 = CMP-26527-000099-1: as R25 on sheet MAIN; Max Operating Temperature: 155°C; Width: 0.031inch; Height: 0.02inch; Lead Free: Lead Free; Contact Plating: Tin; Tolerance: 1%; Resistor Type: Thin Film; Series: RNCP; RoHS Compliant: Yes; Features: Moisture Resistant; Min Operating Temperature: -55°C; Case Code (Metric): 1608; Case/Package: 0603; Mount: Surface Mount; Packaging: Tape and Reel; Radiation Hardening: No; Length: 0.059inch; Number of Terminations: 2; Case Code (Imperial): 0603
R12 = CMP-26527-006079-1: as R28 on sheet MAIN; Radiation Hardening: No; Case Code (Metric): 1608; RoHS Compliant: Yes; Height: 0.022inch; Case/Package: 0603; Construction: Rectangular; Case Code (Imperial): 0603; Series: RMCF; Military Standard: Not; Max Operating Temperature: 155°C; Resistor Type: Thick Film; Depth: 0.8mm; Features: Automotive AEC-Q200; Width: 0.031inch; Length: 1.55mm; Size Code: 0603; Mount: Surface Mount; Contact Plating: Tin; Max Power Dissipation: 100mW; Number of Terminations: 2; Min Operating Temperature: -55°C; Packaging: Tape and Reel; Lead Free: Lead Free; Tolerance: 1%
TP12-TP22 = CMP-00086-1
U3 = CMP-00083-1: Board Connector, 10 Contact(s), 2 Row(s), Male, Straight, 0.05 inch Pitch, Solder Terminal, Locking, Black Insulator, Receptacle; Number Of PCB Rows: 2; PCB Contact Pattern: RECTANGULAR; Option: General Purpose; Body Depth: 0.098inch; Insulation Resistance: 100MR; Dielectric Withstanding Voltage (AC): 700V; Withdrawl Force-Min: 0.1946N; Body Length: 0.25inch; IEC Conformance: No; Body Breadth: 0.135inch; Rated Current (Signal): 1A; Plating Thickness: 10uin; Reliability: COMMERCIAL; Number Of Connectors: 1; PCB Contact Row Spacing: 1.27mm; Insertion Force-Max: 2.1406N; Contact Style: SQ PIN-SKT; Durability: 100Cycles; Contact Resistance: 30mR; Number of Contacts: 10; Reference Standard: UL; Insulation Material: Thermoplastic; Connector Type: BOARD CONNECTOR; Termination: Solder; Contact Finish - Mating: GOLD (10); Mounting Technology: Board; RoHS Compliant: Yes; Terminal Length: 0.091inch; Body/Shell Style: RECEPTACLE; Number of Rows Loaded: 2; Contact Gender: Male; Terminal Pitch: 1.27mm; Max Operating Temperature: 125°C; Mounting Option 1: LOCKING; JESD-609 Code: e3; DIN Conformance: No; Reach SVHC Compliant: Yes; Contact Finish - Termination: Matte Tin (Sn); Mounting Style: STRAIGHT; Min Operating Temperature: -40°C; MIL Conformance: No; Contact Material: Copper Alloy; Filter Feature: No; Mating Contact Pitch: 0.05inch; Insulation Color: Black; Flammability Rating: UL94 V-0; Mating Contact Row Spacing: 0.05inch; Mixed Contacts: No; Contact Pattern: RECTANGULAR
U4 = CMP-00082-2: 2.7 - 4.2 V 65 Mbps 17 dbm 256 kB Flash 32 kB SRAM 802.11 b/g/n Smart Module
X1 = CMP-0447-00001-4: Crystal 32.768kHz ±20ppm (Tol) 12.5pF FUND 70kΩ 2-Pin CSMD T/R; ESR (Equivalent Series Resistance): 70kR; Frequency: 32.768kHz; Radiation Hardening: No; Length: 3.2mm; Max Operating Temperature: 85°C; Number of Pins: 2; Series: ABS07; Min Operating Temperature: -40°C; Frequency Tolerance: 20ppm; Packaging: Tape and Reel; Height: 0.9mm; Width: 1.5mm; Depth: 1.5mm; Load Capacitance: 12.5pF; RoHS Compliant: Yes; Tolerance: 20ppm; Termination: SMD/SMT; Lead Free: Lead Free; Series Resistance: 70kR; REACH SVHC: No SVHC; Case/Package: CSMD; Operating Frequency: 32.768 kHz; Package Quantity: 3000

## Sheet Memory.SchDoc
size Letter; Author: Lihong; Chenwei; SheetNumber: 2; SheetTotal: 8
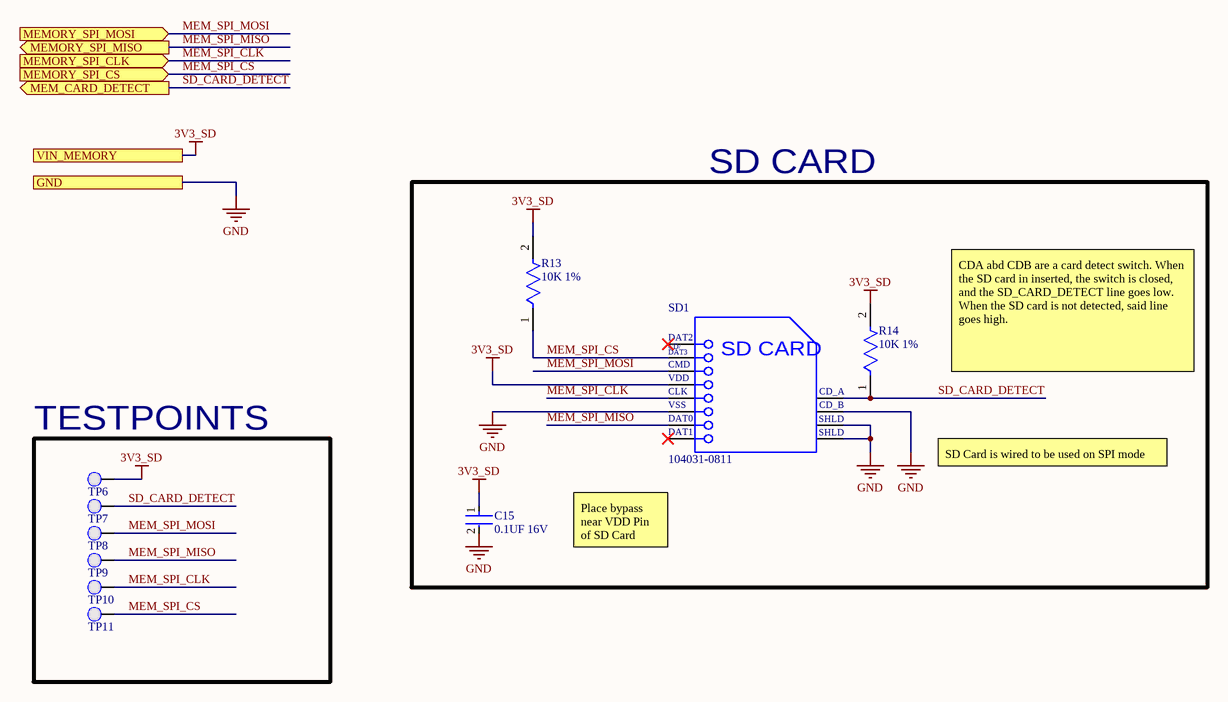
[diagram p3: Memory.SchDoc]

### Parts
C15  0.1UF 16V  [FP-CC0402-MFG]
R13  10K 1%  [FP-RNCP0603-IPC_A]
R14  10K 1%  [FP-RNCP0603-IPC_A]
SD1  104031-0811  [MOLX-104031-0811_V]
TP6  Test Point 0.1"  [Test Point 0.1"-Footprint-1]  (value not drawn)
TP7  Test Point 0.1"  [Test Point 0.1"-Footprint-1]  (value not drawn)
TP8  Test Point 0.1"  [Test Point 0.1"-Footprint-1]  (value not drawn)
TP9  Test Point 0.1"  [Test Point 0.1"-Footprint-1]  (value not drawn)
TP10  Test Point 0.1"  [Test Point 0.1"-Footprint-1]  (value not drawn)
TP11  Test Point 0.1"  [Test Point 0.1"-Footprint-1]  (value not drawn)

### Blocks framed on the sheet
SD CARD: C15 R13 R14 SD1
TESTPOINTS: TP6-TP11

### Ports
GND, MEM_CARD_DETECT (out), MEMORY_SPI_CLK (in), MEMORY_SPI_CS (in), MEMORY_SPI_MISO (out), MEMORY_SPI_MOSI (in), VIN_MEMORY

### Nets
3V3_SD: C15.1 R13.2 R14.2 SD1.4(VDD) TP6.1(PAD) ; port VIN_MEMORY  [project net 3V3]
GND: C15.2 SD1.6(VSS2) SD1.10(CD_B) SD1.11(SHLD1) SD1.12(SHLD2) ; port GND
MEM_SPI_CLK: SD1.5(CLK) TP10.1(PAD) ; port MEMORY_SPI_CLK
MEM_SPI_CS: R13.1 SD1.2(CMD) TP11.1(PAD) ; port MEMORY_SPI_CS  [project net FLASH_MEM_SPI_SS]
MEM_SPI_MISO: SD1.7(DAT0) TP9.1(PAD) ; port MEMORY_SPI_MISO
MEM_SPI_MOSI: SD1.3(VSS1) TP8.1(PAD) ; port MEMORY_SPI_MOSI
SD_CARD_DETECT: R14.1 SD1.9(CD_A) TP7.1(PAD) ; port MEM_CARD_DETECT

Not connected (* = marked no-connect by the designer): SD1 1(CD/DAT3)* 8(DAT1)*

### Notes on the sheet
- CDA abd CDB are a card detect switch. When the SD card in inserted, the switch is closed, and the SD_CARD_DETECT line goes low. When the SD card is not detected, said line goes high.
- SD Card is wired to be used on SPI mode
- Place bypass near VDD Pin of SD Card
- Title:
- Desc:
- Size:
- Letter
- Auth:
- Proj:
- Sheet
- of
- www.seas.upenn.edu
- Electrical and Systems Engineering
- (in symbol CMP-2000-05825-1) DAT2; CD/; DAT3; SD CARD; VSS; SHLD

### Library data of the parts
C15 = CMP-03422-000946-1: as C1 on sheet FTDI; Footprint Url: http://www.yageo.com/exep/pages/download/literatures/UPY-C_GEN_24.pdf; ComponentLink2Description: Datasheet; Device Class L2: Capacitors; Device Class L3: Ceramic Capacitors; Height: 0.55mm; Ipc Land Pattern Name: CAPC10050X50; Category: Cap; ComponentLink2URL: http://www.yageo.com/documents/recent/UPY-GP_NP0_16V-to-50V_16.pdf; Automotive: No; Temperature: -55°C to +125°C; Lead Free: Yes; Temperature Range High: +125°C; Temperature Range Low: -55°C; Temperature Characteristic: X7R; Package: CC0402; RoHS: TRUE; Octopart: https://octopart.com/cc0402kpx7r8bb104-yageo-61757486; Device Class L1: Passive Components
R13 R14 = CMP-26527-000099-1: as R25 on sheet MAIN; Max Operating Temperature: 155°C; Width: 0.031inch; Height: 0.02inch; Lead Free: Lead Free; Contact Plating: Tin; Tolerance: 1%; Resistor Type: Thin Film; Series: RNCP; RoHS Compliant: Yes; Features: Moisture Resistant; Min Operating Temperature: -55°C; Case Code (Metric): 1608; Case/Package: 0603; Mount: Surface Mount; Packaging: Tape and Reel; Radiation Hardening: No; Length: 0.059inch; Number of Terminations: 2; Case Code (Imperial): 0603
SD1 = CMP-2000-05825-1: Micro SD Card, RA, -25 to 85 degC, 8-Pin SMD, RoHS, Tape and Reel; Voltage Rating: 10VAC/DC; Number of Contacts: 8; Insertion - Extraction Style: Push-Pull; Pitch: 1.1mm; Mating Cycles: 10000; Brand: Molex; Current Rating: 500mA; Manufacturer URL: http://www.molex.com/; Card Type: microSD; Mounting Type: Standard; Height: 1.42mm; Mounting Technology: SurfaceMount; Contact Plating: Gold; Product Category: MemoryCardConnectors; Package Description: 8-Pin Surface Mount Device, Body 11.95 x 11.4 mm, Pitch 1.1 mm; Datasheet URL: http://www.molex.com/pdm_docs/sd/1040310811_sd.pdf; Termination Style: SMD; Length: 11.4mm; Housing Material: LiquidCrystalPolymer(LCP); Orientation: RightAngle; RoHS: True; Contact Material: PhosphorBronze; Datasheet Version: Rev. E, 04/2006; Packaging: Reel; Manufacturer: Molex; Series: 104031; Product: CardConnectors; Number of Rows: 1Row; Package Reference: 104031-0811
TP6-TP11 = CMP-00086-1

## Sheet LiPo_Charger.SchDoc
size Letter; Author: Lihong; Chenwei; SheetNumber: 6; SheetTotal: 8
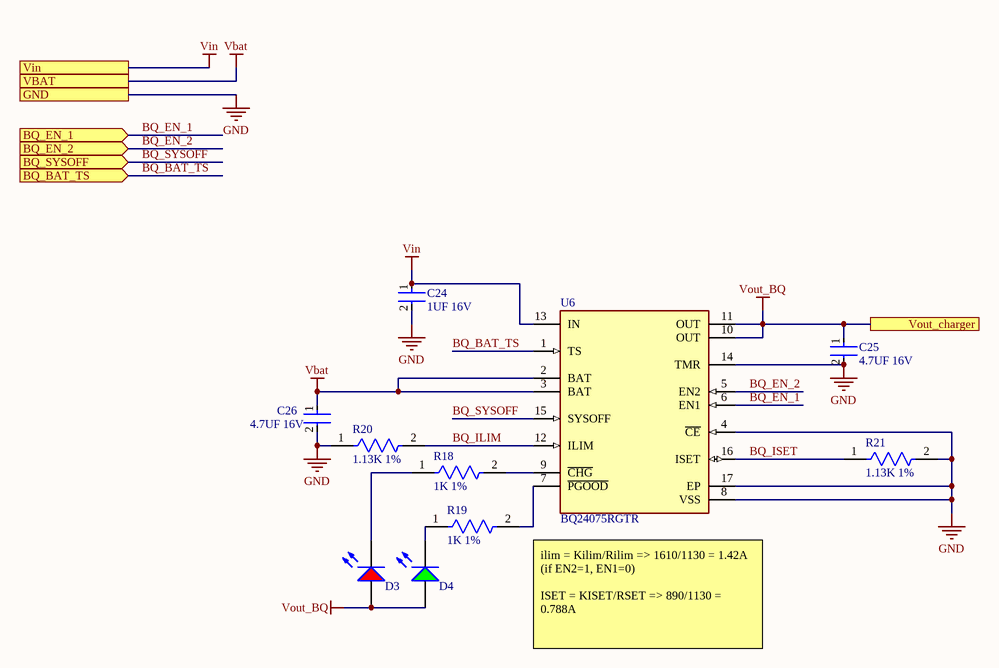
[diagram p4: LiPo_Charger.SchDoc]

### Parts
C24  1UF 16V  [FP-CC0603-DA-MFG]
C25  4.7UF 16V  [FP-CC0402-MFG]
C26  4.7UF 16V  [FP-CC0402-MFG]
D3  LSM0805412V  [LED_0805_RED]  (value not drawn)
D4  LSM0805452V  [LED_0805]  (value not drawn)
R18  1K 1%  [FP-RNCP0603-IPC_C]
R19  1K 1%  [FP-RNCP0603-IPC_C]
R20  1.13K 1%  [FP-RMCF1210-IPC_C]
R21  1.13K 1%  [FP-RMCF1210-IPC_C]
U6  BQ24075RGTR  [FP-RGT0016C-IPC_A]

### Ports
BQ_BAT_TS (in), BQ_EN_1 (in), BQ_EN_2 (in), BQ_SYSOFF (in), GND, VBAT, Vin, Vout_charger

### Nets
GND: C24.2 C25.2 C26.2 R20.1 R21.2 U6.4(~{CE}) U6.5(EN2) U6.8(VSS) U6.14(TMR) U6.15(SYSOFF) U6.17(EP) ; port BQ_EN_2, port BQ_SYSOFF, port GND  [also labelled BQ_EN_2, BQ_SYSOFF]
VBAT: C26.1 U6.2(BAT) U6.3(BAT) ; port VBAT
Vin: C24.1 U6.13(IN) ; port Vin  [project net VUSB]
Vout_BQ: C25.1 D3.A D4.A U6.6(EN1) U6.10(OUT) U6.11(OUT) ; port BQ_EN_1, port Vout_charger  [also labelled BQ_EN_1]
BQ_BAT_TS: U6.1(TS) ; port BQ_BAT_TS
BQ_ILIM: R20.2 U6.12(ILIM)
BQ_ISET: R21.1 U6.16(ISET)
NetD3_K: D3.K R18.1
NetD4_K: D4.K R19.1
NetR18_2: R18.2 U6.9(~{CHG})
NetR19_2: R19.2 U6.7(~{PGOOD})

### Notes on the sheet
- ilim = Kilim/Rilim => 1610/1130 = 1.42A (if EN2=1, EN1=0)
  ISET = KISET/RSET => 890/1130 = 0.788A
- Title:
- Desc:
- Size:
- Letter
- Auth:
- Proj:
- Sheet
- of
- www.seas.upenn.edu
- Electrical and Systems Engineering

### Library data of the parts
C24 = CMP-03422-001047-1: as C8 on sheet MAIN; Device Class L3: Ceramic Capacitors; Temperature Characteristic: X7R; Device Class L2: Capacitors; Temperature Range Low: -55°C; Footprint Url: http://www.yageo.com/exep/pages/download/literatures/UPY-C_GEN_24.pdf; Device Class L1: Passive Components; Temperature: -55°C to +125°C; Voltage Rating: 16 V; RoHS: TRUE; ComponentLink2URL: http://www.yageo.com/documents/recent/UPY-GPHC_X7R_6.3V-to-50V_18.pdf; Mouser Description: Cap Ceramic 1uF 16V X7R 10% SMD 0603 125°C Paper T/R; Octopart: https://octopart.com/cc0603kpx7r7bb105-yageo-25629533; Automotive: No; Capacitance: 1 uF; Height: 0.9mm; Voltage: 16 V; Lead Free: Yes; Category: Cap; Package: CC0603-DA; Temperature Range High: +125°C; Value: 1 uF; ComponentLink2Description: Datasheet
C25 C26 = CMP-03422-000634-1: as C4 on sheet FTDI; ComponentLink2URL: http://www.yageo.com/documents/recent/UPY-GP_NP0_16V-to-50V_16.pdf; Digikey Description: CAP CER 4700PF 25V X7R 0402; RoHS: TRUE; Ipc Land Pattern Name: CAPC10050X50; Footprint Url: http://www.yageo.com/exep/pages/download/literatures/UPY-C_GEN_24.pdf; Voltage Rating: 25 V; Mouser Description: 0402 4.7 nF 25 V ±10 % Tolerance X7R SMT Multilayer Ceramic Capacitor; Device Class L3: Ceramic Capacitors; Device Class L1: Passive Components; ComponentLink2Description: Datasheet; Temperature Range Low: -55°C; Device Class L2: Capacitors; Category: Cap; Octopart: https://octopart.com/cc0402krx7r8bb472-yageo-40254851; Lead Free: Yes; Height: 0.55mm; Temperature: -55°C to +125°C; Automotive: No; Temperature Range High: +125°C; Capacitance: 4.7 nF; Package: CC0402; Temperature Characteristic: X7R
D3 = CMP-00026-00001-1: as D5 on sheet FTDI; RoHS Compliant: Yes
D4 = CMP-00038-3: as D6 on sheet MAIN; RoHS Compliant: Yes
R18 R19 = CMP-26527-006179-1: as R6 on sheet MAIN; Case/Package: 0603; Width: 0.031inch; Tolerance: 1%; Case Code (Imperial): 0603; RoHS Compliant: Yes; Min Operating Temperature: -55°C; Resistor Type: Thin Film; Features: Moisture Resistant; Length: 0.059inch; Mount: Surface Mount; Case Code (Metric): 1608; Height: 0.02inch; Max Operating Temperature: 155°C; Packaging: Tape and Reel; Series: RNCP; Number of Terminations: 2
R20 R21 = CMP-26527-006360-1: 1.13kΩ ±1% 0.5W 1210 Thick Film Chip Resistor AEC-Q200 compliant; Temperature Coefficient: 100ppm/°C; Resistance: 1.13kR; Max Power Dissipation: 333mW; Resistor Type: Thick Film; Height: 0.028inch; Min Operating Temperature: -55°C; Case Code (Imperial): 1210; Radiation Hardening: No; Width: 0.098inch; RoHS Compliant: Yes; Number of Terminations: 2; Case Code (Metric): 3225; Series: RMCF; Case/Package: 1210; Length: 0.126inch; Mount: Surface Mount; Contact Plating: Tin; Features: Automotive AEC-Q200; Max Operating Temperature: 155°C; Packaging: Tape and Reel; Tolerance: 1%
U6 = CMP-0321-00238-3: IC LI-ION CHARGE MGMT 16-QFN; Max Supply Voltage: 6.4V; Number of Cells: 1; Min Supply Voltage: 4.35V; Battery Chemistry: LITHIUM-ION; Max Charge Current: 1.5A; Output Voltage: 4.2V; Interface: USB; Min Input Voltage: 4.3V; Fault Protection: Over Voltage; Weight: 0.000808oz; Package Quantity: 3000; Min Operating Temperature: -40°C; Case/Package: VQFN; Lead Free: Lead Free; Number of Pins: 16; RoHS Compliant: Yes; Series: -; Packaging: Tape and Reel; Output Current: 1.5A; Contact Plating: Gold; Battery Pack Voltage: 4.2V; Max Operating Temperature: 125°C; Radiation Hardening: No